# EAGLE design Nebula template (EAGLE 5.11)
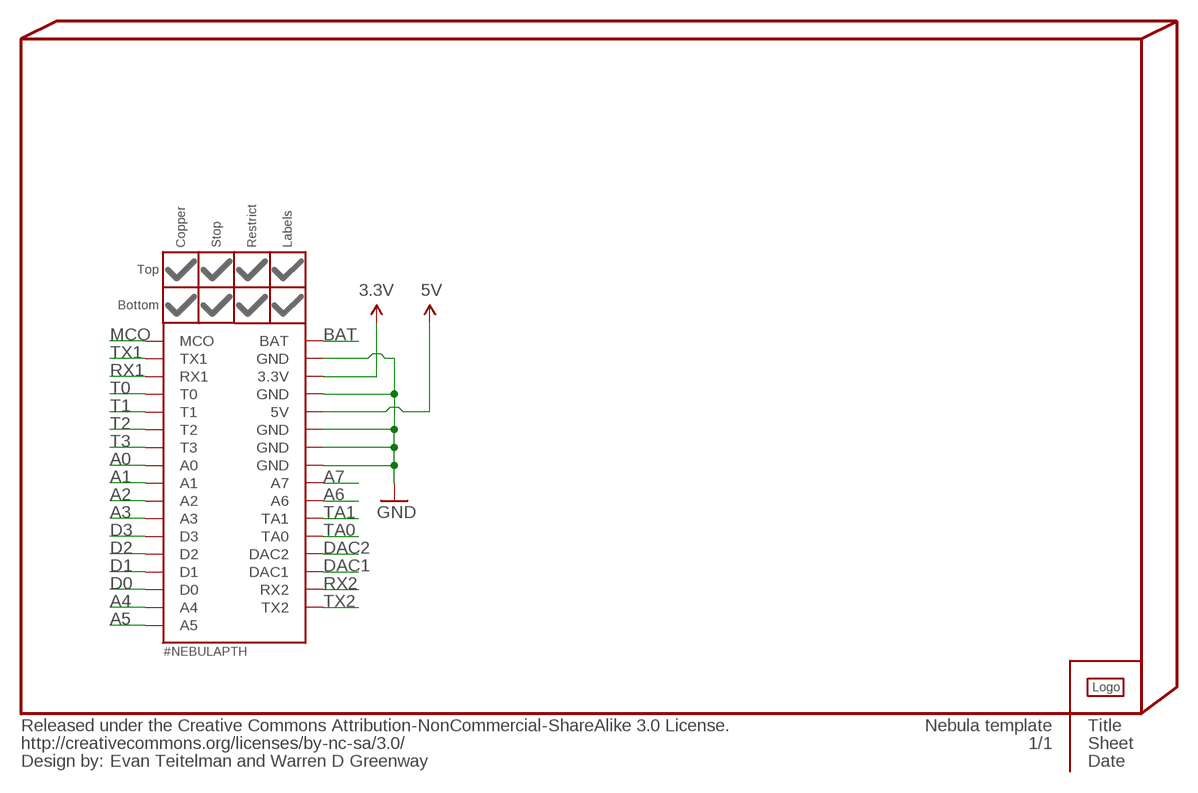
[diagram p0: schematic, sheet 1]

## Parts
INFO2  Evan Teitelman and Warren D Greenway  %CC-NC-SA  [%CC-NC-SA]
LOGO1  #LOGOA-THICK  [#LOGOA-THICK]
NEBULA1  #NEBULAPTH  [#NEBULA-PTH]
PART1  #NEBULA-PARTSTOP  [#NEBULA-STOP]
PART2  #NEBULA-PARTRESTRICT  [#NEBULA-RESTRICT]
PART3  #NEBULA-PARTCOPPER  [#NEBULA-COPPER]
PART4  #NEBULA-PARTLABELS-TOP  [#NEBULA-LABELS-TOP]

## Nets
3.3V: NEBULA1.3.3V ; supply symbol labelled @3.3V
5V: NEBULA1.5V ; supply symbol labelled @5V
A0: NEBULA1.A0
A1: NEBULA1.A1
A2: NEBULA1.A2
A3: NEBULA1.A3
A4: NEBULA1.A4
A5: NEBULA1.A5
A6: NEBULA1.A6
A7: NEBULA1.A7
BAT: NEBULA1.BAT
D0: NEBULA1.D0
D1: NEBULA1.D1
D2: NEBULA1.D2
D3: NEBULA1.D3
DAC1: NEBULA1.DAC1
DAC2: NEBULA1.DAC2
GND: NEBULA1.GND1(GND) NEBULA1.GND2(GND) NEBULA1.GND3(GND) NEBULA1.GND4(GND) NEBULA1.GND5(GND) ; supply symbol labelled @GND
MCO: NEBULA1.MCO
RX1: NEBULA1.COM1_RX(RX1)
RX2: NEBULA1.COM2_RX(RX2)
T0: NEBULA1.T0
T1: NEBULA1.T1
T2: NEBULA1.T2
T3: NEBULA1.T3
TA0: NEBULA1.TA0
TA1: NEBULA1.TA1
TX1: NEBULA1.COM1_TX(TX1)
TX2: NEBULA1.COM2_TX(TX2)

## Library data of the parts
INFO2 = PygmyBoards:%CC-NC-SA: Released under the Creative Commons Attribution-NonCommercial-ShareAlike 3.0 License. http://creativecommons.org/licenses/by-sa/3.0 Design by: [Designer Name] Change this part's value to change the designer name
LOGO1 = PygmyBoards:#LOGO
NEBULA1 = PygmyBoards:#NEBULA: Nebula Board and Shield Footprint Pads This is the only absolutely required part for the footprint. The parts in "#NEBULA-PART" are merely aesthetic. A circular board outline should be .001" thick and 1.005" in diameter (Reference circle on the Document (48) layer provided).
PART1-PART4 = PygmyBoards:#NEBULA-PART: Nebula Board and Shield Footprint Parts These parts are only functional when combined with the pads in "#NEBULA".

## Board
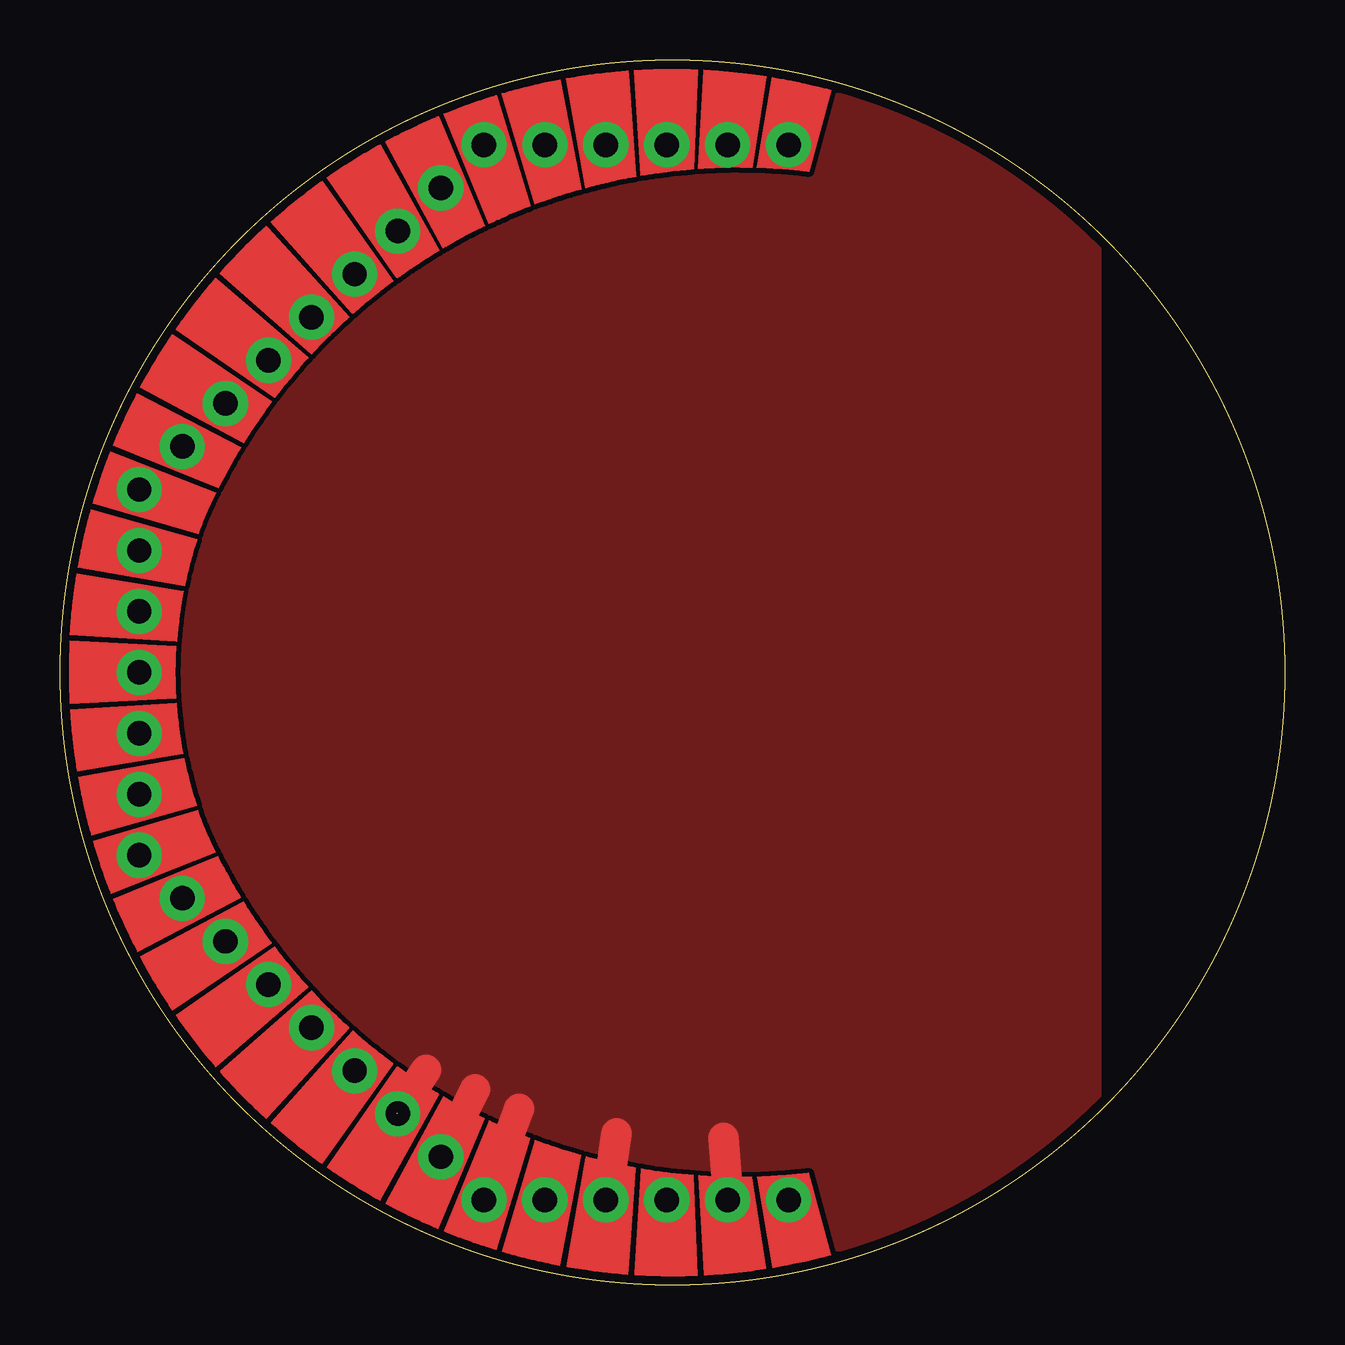
[diagram p1: board, top side]
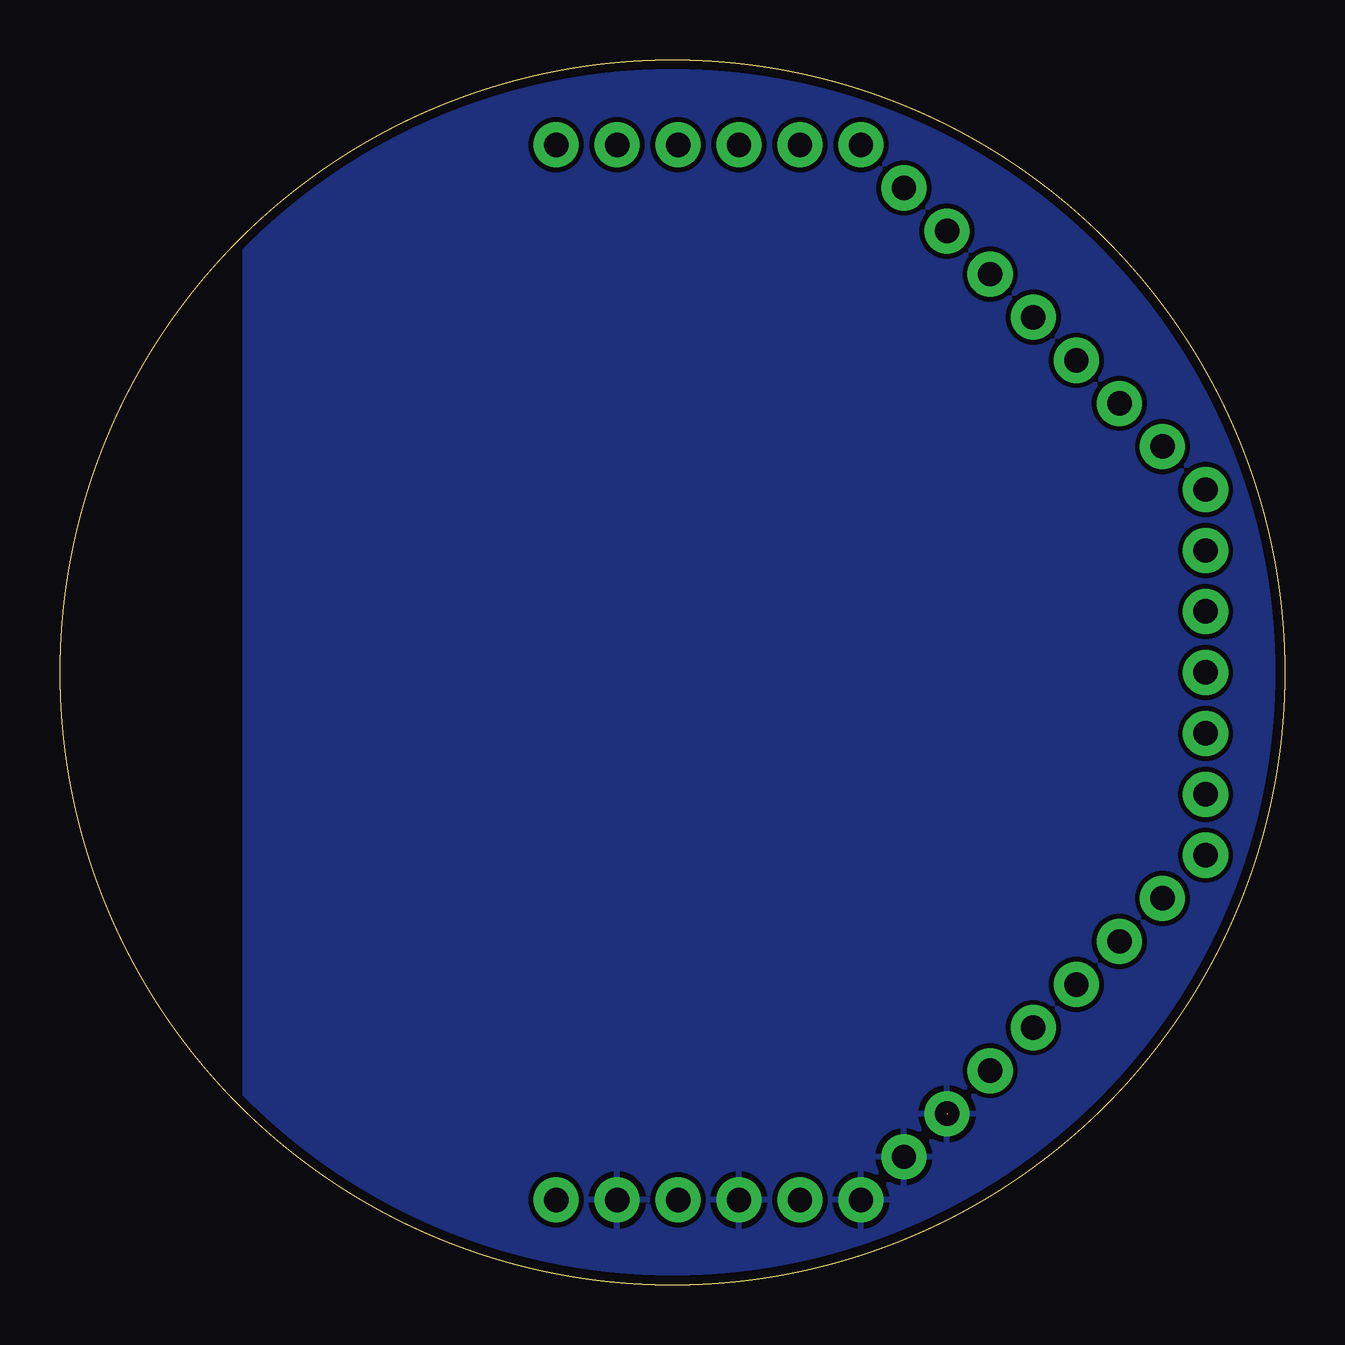
[diagram p2: board, bottom side, seen from below]

Size 51.05 x 51.05 mm. Coordinates in mm from the lower left corner, seen from the top.
Outline: circle at 25.53,25.53 radius 25.53
Copper layers (1*16): Top 0.035mm / dielectric 1.5mm / Bottom 0.035mm
Design rules: minimum track width 6mil, minimum drill 15mil, track to track 6mil, track to pad 6mil, pad to pad 4mil, via to via 6mil, smd to smd 4mil, copper to edge 15mil, drill to drill 6mil, minimum pad ring 10mil, minimum via ring 8mil, stop-mask expansion 4mil, vias tented up to drill 25mil, thermal gap 10mil

### Footprints (pad centres in the part's own frame; a part is rotated, then mirrored left to right if it is on the bottom)
#NEBULA-PTH = drill 1.016 pad 1.88: 3.3V -25.637,-47.388; 5V -30.716,-47.388; A0 -36.848,-7.004; A1 -38.645,-8.8; A2 -40.44,-10.596; A3 -42.237,-12.392; A4 -47.625,-22.86; A5 -47.625,-25.4; A6 -40.44,-40.204; A7 -38.645,-42; BAT -20.557,-47.388; COM1_RX -25.636,-3.412; COM1_TX -23.096,-3.412; COM2_RX -47.625,-30.48; COM2_TX -47.625,-27.94; D0 -47.625,-20.32; D1 -47.625,-17.78; D2 -45.829,-15.984; D3 -44.032,-14.188; DAC1 -47.625,-33.02; DAC2 -45.829,-34.816; GND1 -36.848,-43.796; GND2 -35.052,-45.592; GND3 -33.256,-47.388; GND4 -28.177,-47.388; GND5 -23.097,-47.388; MCO -20.556,-3.412; T0 -28.176,-3.412; T1 -30.716,-3.412; T2 -33.256,-3.412; T3 -35.052,-5.208; TA0 -44.032,-36.612; TA1 -42.237,-38.408

### Placement (x,y rotation side)
INFO2  -2.41,-10.03 0 top  (outside the outline)
LOGO1  28.07,34.42 0 bottom
NEBULA1  50.93,50.93 0 top
PART1  50.93,50.93 0 top
PART2  50.93,50.93 0 top
PART3  50.93,50.93 0 top
PART4  50.93,50.93 0 top

### Tracks (layer width: path | path; a pad name or v marks a point on that pad's centre or on a via)
GND  (1 unrouted)
  Top 1.27: 14.05,7.14 15.27,8.97 | 15.88,5.31 17.3,8.15 | 17.7,3.48 19.13,7.34 | 22.78,3.48 23.19,6.32 | 27.86,3.48 27.66,6.12
  pour Bottom (isolate 0.203): -2.41,-2.41 43.31,-2.41 43.31,53.47 -2.41,53.47
  pour Top (isolate 0.203): -1.14,-1.14 43.31,-1.14 43.31,52.2 -1.14,52.2

### Text on the board
bTest: Pygmy <board name> Shield | Version 1 | Designed By: | Evan Teitelman | Warren D Greenway
Document: Pygmy <name> Shield | Version 1.0 | Standard Grid: 50mil | Routing Grids: 8mil / 4mil